# Altium schematic sheet 04-RS485+CAN.SchDoc: 手持设备通讯板
size A4; Address1: 张三; Address2: 441521200506202339; Address3: 15812345678; SheetNumber: 7; SheetTotal: 7
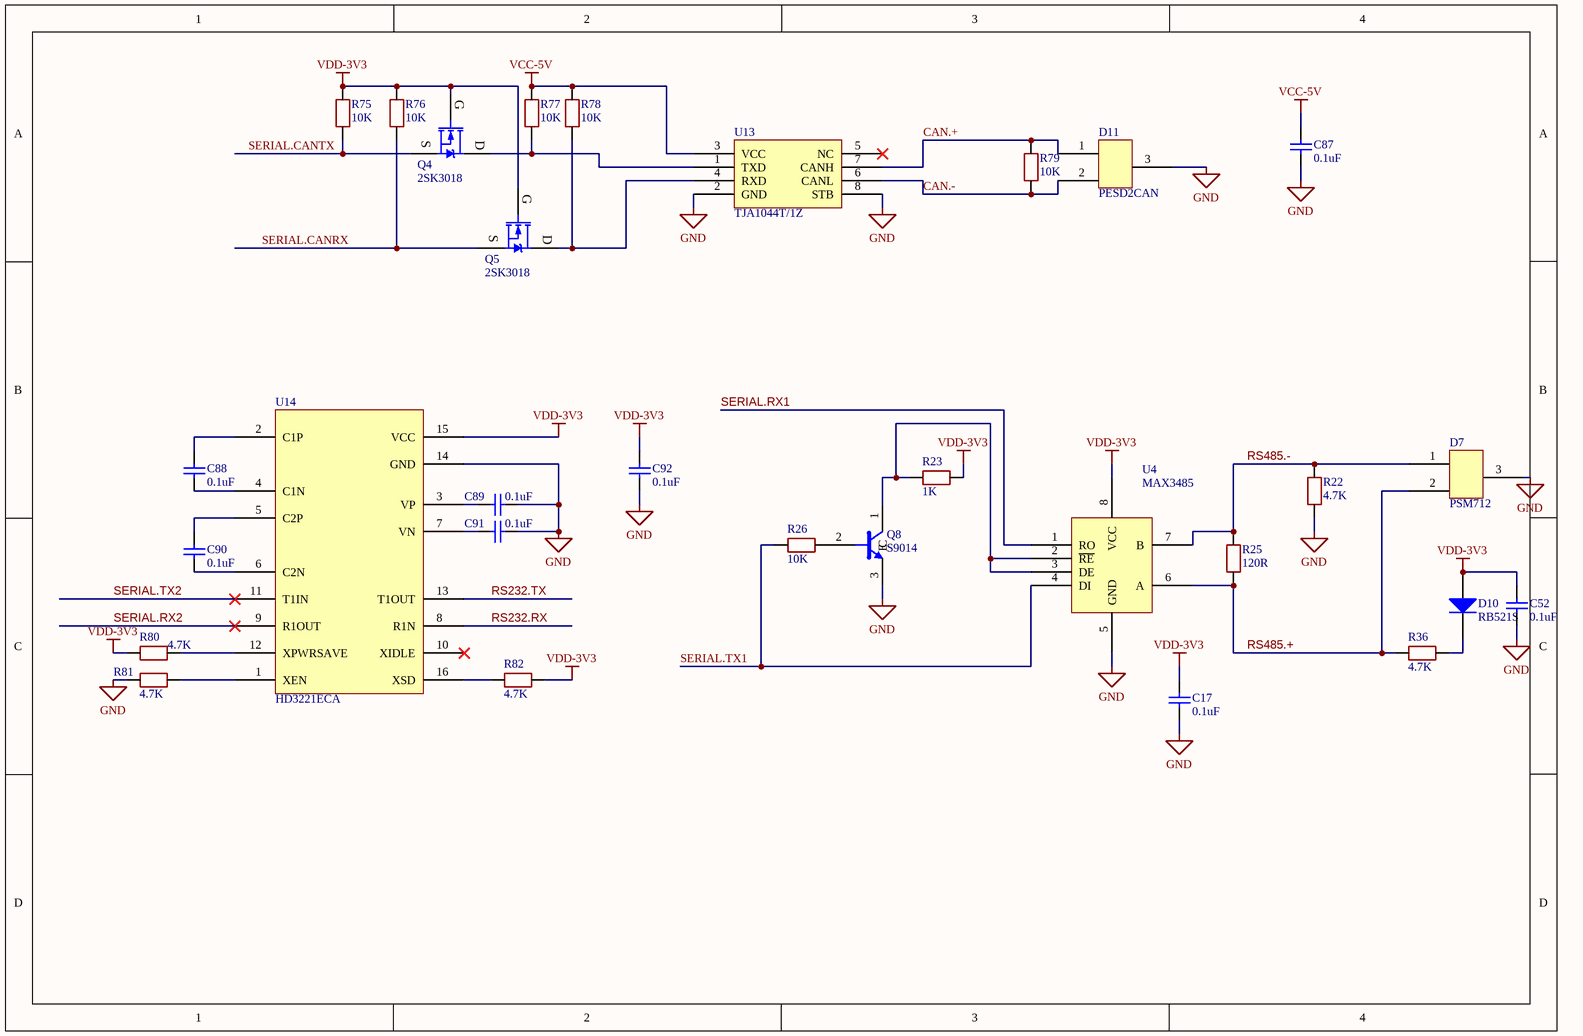
[diagram p0: 04-RS485+CAN.SchDoc]

## Parts
C17  0.1uF  [C0402]
C52  0.1uF  [C0402]
C87  0.1uF  [C0402]
C88  0.1uF  [C0402]
C89  0.1uF  [C0402]
C90  0.1uF  [C0402]
C91  0.1uF  [C0402]
C92  0.1uF  [C0402]
D7  PSM712  [SOT-23-3_L3.0-W1.7-P0.95-LS2.9-BR]
D10  RB521S  [SOD-523_L1.2-W0.8-LS1.6-RD]
D11  PESD2CAN  [SOT-23-3_L3.0-W1.7-P0.95-LS2.9-BR]
Q4  2SK3018  [SOT-23-3_L2.9-W1.6-P1.90-LS2.8-BR]
Q5  2SK3018  [SOT-23-3_L2.9-W1.6-P1.90-LS2.8-BR]
Q8  S9014  [SOT-23-3_L2.9-W1.6-P1.90-LS2.8-BR]
R22  4.7K  [R0402]
R23  1K  [R0402]
R25  120R  [R0402]
R26  10K  [R0402]
R36  4.7K  [R0402]
R75  10K  [R0402]
R76  10K  [R0402]
R77  10K  [R0402]
R78  10K  [R0402]
R79  10K  [R0402]
R80  4.7K  [R0402]
R81  4.7K  [R0402]
R82  4.7K  [R0402]
U4  MAX3485  [SOIC-8_L4.9-W3.9-P1.27-LS6.0-BL]
U13  TJA1044T/1Z  [SOIC-8_L4.9-W3.9-P1.27-LS6.0-BL]
U14  HD3221ECA  [SSOP-16_L6.2-W5.3-P0.65-LS7.8-BL]

## Nets
GND: C17.1 C52.1 C87.1 C89.1 C91.1 C92.1 D7.3 D11.3 Q8.3(E) R22.2 R81.2 U4.5(GND) U13.2(GND) U13.8(STB) U14.14(GND)
VCC-5V: C87.2 R77.2 R78.2 U13.3(VCC)
VDD-3V3: C17.2 C52.2 C92.2 D10.1(A) Q4.1(G) Q5.1(G) R23.1 R75.2 R76.2 R80.2 R82.1 U4.8(VCC) U14.15(VCC)
CAN.+: D11.1 R79.2 U13.7(CANH)
CAN.-: D11.2 R79.1 U13.6(CANL)
RS232.RX: U14.8(R1N)
RS232.TX: U14.13(T1OUT)
RS485.+: D7.2 R25.2 R36.2 U4.6(A)
RS485.-: D7.1 R22.1 R25.1 U4.7(B)
SERIAL.CANRX: Q5.2(S) R76.1
SERIAL.CANTX: Q4.2(S) R75.1
SERIAL.RX1: U4.1(RO)
SERIAL.RX2: U14.9(R1OUT)
SERIAL.TX1: R26.2 U4.4(DI)
SERIAL.TX2: U14.11(T1IN)
NetC88_1: C88.1 U14.4(C1N)
NetC88_2: C88.2 U14.2(C1P)
NetC89_2: C89.2 U14.3(VP)
NetC90_1: C90.1 U14.6(C2N)
NetC90_2: C90.2 U14.5(C2P)
NetC91_2: C91.2 U14.7(VN)
NetD10_2: D10.2(K) R36.1
NetQ4_3: Q4.3(D) R77.1 U13.1(TXD)
NetQ5_3: Q5.3(D) R78.1 U13.4(RXD)
NetQ8_1: Q8.1(C) R23.2 U4.2(~{RE}) U4.3(DE)
NetQ8_2: Q8.2(B) R26.1
NetR80_1: R80.1 U14.12(XPWRSAVE)
NetR81_1: R81.1 U14.1(XEN)
NetR82_2: R82.2 U14.16(XSD)

Not connected (* = marked no-connect by the designer): U13 5(NC)*; U14 10(XIDLE)*

## Notes on the sheet
- 选手信息
- 图页名称
- 当前日期
- 当前时间
- 项目名称
- 第          幅
- 共          幅

## Library data of the parts
C17 C52 C87-C92 = CAP1
D7 = PESD2CAN
D10 = DIODE
Q4 Q5 = 2N7002
Q8 = NPN
R22 R23 R25 R26 R36 R75-R82 = R